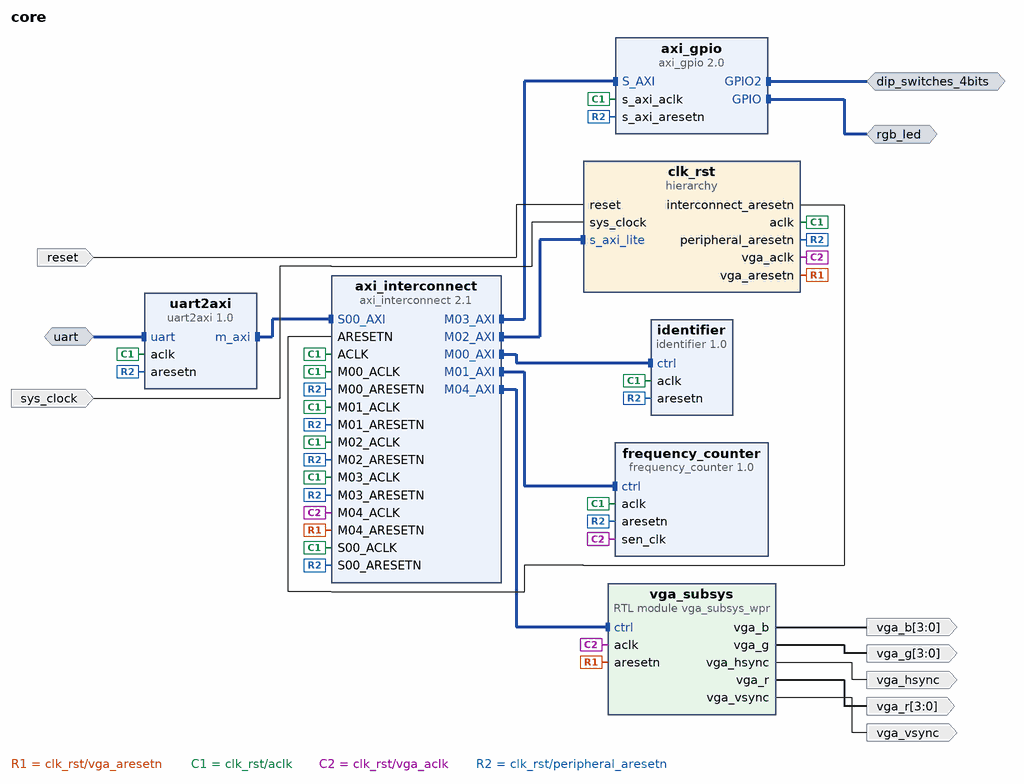
[diagram p0: block diagram of the top level]
# Vivado block design core, xc7a35ticsg324-1L, Vivado 2022.2
create_bd_design core

create_bd_intf_port -mode MirroredMaster -vlnv xilinx.com:interface:uart_rtl:1.0 uart
create_bd_intf_port -mode Master -vlnv xilinx.com:interface:gpio_rtl:1.0 rgb_led
create_bd_intf_port -mode Master -vlnv xilinx.com:interface:gpio_rtl:1.0 dip_switches_4bits
create_bd_port -dir I -type clk sys_clock
set_property -dict {CONFIG.FREQ_HZ 100000000 CONFIG.PHASE 0.0} [get_bd_ports sys_clock]
create_bd_port -dir I -type rst reset
set_property -dict {CONFIG.POLARITY ACTIVE_LOW} [get_bd_ports reset]
create_bd_port -dir O vga_hsync
create_bd_port -dir O -from 3 -to 0 vga_b
create_bd_port -dir O -from 3 -to 0 vga_r
create_bd_port -dir O -from 3 -to 0 vga_g
create_bd_port -dir O vga_vsync

create_bd_cell -type ip -vlnv xilinx.com:ip:axi_interconnect:2.1 axi_interconnect
set_property -dict {CONFIG.NUM_MI 5} [get_bd_cells axi_interconnect]
create_bd_cell -type ip -vlnv xilinx.com:ip:axi_gpio:2.0 axi_gpio
set_property -dict [list \
  CONFIG.GPIO2_BOARD_INTERFACE dip_switches_4bits \
  CONFIG.GPIO_BOARD_INTERFACE rgb_led \
  CONFIG.USE_BOARD_FLOW true \
] [get_bd_cells axi_gpio]
create_bd_cell -type hier clk_rst
create_bd_cell -type ip -vlnv lvin:versioning:identifier:1.0 identifier
set_property -dict {CONFIG.MAJOR_VERSION 2 CONFIG.MINOR_VERSION 0 CONFIG.NAME {Main build}} [get_bd_cells identifier]
create_bd_cell -type module -reference vga_subsys_wpr vga_subsys
create_bd_cell -type ip -vlnv lvin:interfaces:uart2axi:1.0 uart2axi
create_bd_cell -type ip -vlnv lvin:meters:frequency_counter:1.0 frequency_counter

# ---- hierarchy /clk_rst ----
current_bd_instance /clk_rst
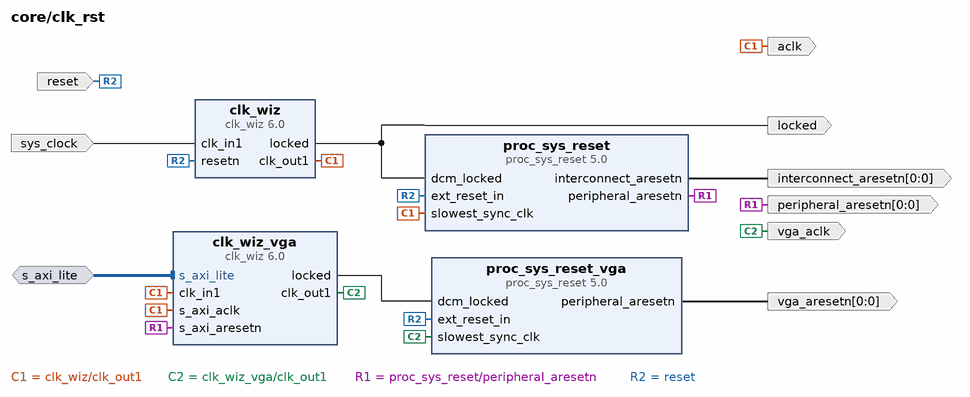
[diagram p1: block diagram inside /clk_rst]
create_bd_intf_pin -mode Slave -vlnv xilinx.com:interface:aximm_rtl:1.0 s_axi_lite
create_bd_pin -dir O -type clk aclk
create_bd_pin -dir I -type rst reset
create_bd_pin -dir O -from 0 -to 0 -type rst interconnect_aresetn
create_bd_pin -dir O -from 0 -to 0 -type rst peripheral_aresetn
create_bd_pin -dir I -type clk sys_clock
create_bd_pin -dir O locked
create_bd_pin -dir O -type clk vga_aclk
create_bd_pin -dir O -from 0 -to 0 -type rst vga_aresetn

create_bd_cell -type ip -vlnv xilinx.com:ip:proc_sys_reset:5.0 proc_sys_reset
create_bd_cell -type ip -vlnv xilinx.com:ip:clk_wiz:6.0 clk_wiz
set_property -dict [list \
  CONFIG.CLKOUT1_JITTER 130.958 \
  CONFIG.CLKOUT1_PHASE_ERROR 98.575 \
  CONFIG.CLKOUT2_JITTER 159.371 \
  CONFIG.CLKOUT2_PHASE_ERROR 98.575 \
  CONFIG.CLKOUT2_REQUESTED_OUT_FREQ 40 \
  CONFIG.CLKOUT2_USED false \
  CONFIG.CLK_IN1_BOARD_INTERFACE sys_clock \
  CONFIG.MMCM_CLKFBOUT_MULT_F 10.000 \
  CONFIG.MMCM_CLKOUT0_DIVIDE_F 10.000 \
  CONFIG.MMCM_CLKOUT1_DIVIDE 1 \
  CONFIG.NUM_OUT_CLKS 1 \
  CONFIG.RESET_BOARD_INTERFACE reset \
  CONFIG.RESET_PORT resetn \
  CONFIG.RESET_TYPE ACTIVE_LOW \
  CONFIG.USE_BOARD_FLOW true \
  CONFIG.USE_RESET true \
] [get_bd_cells clk_wiz]
create_bd_cell -type ip -vlnv xilinx.com:ip:clk_wiz:6.0 clk_wiz_vga
set_property -dict [list \
  CONFIG.CLKOUT1_JITTER 254.866 \
  CONFIG.CLKOUT1_PHASE_ERROR 297.890 \
  CONFIG.CLKOUT1_REQUESTED_OUT_FREQ 65 \
  CONFIG.MMCM_CLKFBOUT_MULT_F 50.375 \
  CONFIG.MMCM_CLKOUT0_DIVIDE_F 15.500 \
  CONFIG.MMCM_DIVCLK_DIVIDE 5 \
  CONFIG.PRIM_SOURCE Global_buffer \
  CONFIG.USE_DYN_RECONFIG true \
] [get_bd_cells clk_wiz_vga]
create_bd_cell -type ip -vlnv xilinx.com:ip:proc_sys_reset:5.0 proc_sys_reset_vga

# ---- connections ----

current_bd_instance /clk_rst
connect_bd_intf_net [get_bd_intf_pins s_axi_lite] [get_bd_intf_pins clk_wiz_vga/s_axi_lite]
connect_bd_net -net ARESETN_1 [get_bd_pins proc_sys_reset/interconnect_aresetn] [get_bd_pins interconnect_aresetn]
connect_bd_net -net clk_wiz_0_clk_out1 [get_bd_pins clk_wiz/clk_out1] \
  [get_bd_pins aclk] [get_bd_pins proc_sys_reset/slowest_sync_clk] [get_bd_pins clk_wiz_vga/clk_in1] \
  [get_bd_pins clk_wiz_vga/s_axi_aclk]
connect_bd_net -net clk_wiz_0_locked [get_bd_pins clk_wiz/locked] [get_bd_pins proc_sys_reset/dcm_locked] [get_bd_pins locked]
connect_bd_net -net clk_wiz_clk_out1 [get_bd_pins clk_wiz_vga/clk_out1] [get_bd_pins vga_aclk] [get_bd_pins proc_sys_reset_vga/slowest_sync_clk]
connect_bd_net -net clk_wiz_locked [get_bd_pins clk_wiz_vga/locked] [get_bd_pins proc_sys_reset_vga/dcm_locked]
connect_bd_net -net proc_sys_reset_0_peripheral_aresetn [get_bd_pins proc_sys_reset/peripheral_aresetn] \
  [get_bd_pins peripheral_aresetn] [get_bd_pins clk_wiz_vga/s_axi_aresetn]
connect_bd_net -net proc_sys_reset_1_peripheral_aresetn [get_bd_pins proc_sys_reset_vga/peripheral_aresetn] [get_bd_pins vga_aresetn]
connect_bd_net [get_bd_pins reset] \
  [get_bd_pins proc_sys_reset/ext_reset_in] [get_bd_pins clk_wiz/resetn] [get_bd_pins proc_sys_reset_vga/ext_reset_in]
connect_bd_net [get_bd_pins sys_clock] [get_bd_pins clk_wiz/clk_in1]

current_bd_instance /
connect_bd_intf_net [get_bd_intf_ports uart] [get_bd_intf_pins uart2axi/uart]
connect_bd_intf_net -intf_net axi_gpio_0_GPIO [get_bd_intf_ports rgb_led] [get_bd_intf_pins axi_gpio/GPIO]
connect_bd_intf_net -intf_net axi_gpio_0_GPIO2 [get_bd_intf_ports dip_switches_4bits] [get_bd_intf_pins axi_gpio/GPIO2]
connect_bd_intf_net -intf_net axi_interconnect_0_M00_AXI [get_bd_intf_pins axi_interconnect/M00_AXI] [get_bd_intf_pins identifier/ctrl]
connect_bd_intf_net -intf_net axi_interconnect_0_M01_AXI [get_bd_intf_pins axi_interconnect/M01_AXI] [get_bd_intf_pins frequency_counter/ctrl]
connect_bd_intf_net -intf_net axi_interconnect_0_M03_AXI [get_bd_intf_pins axi_interconnect/M03_AXI] [get_bd_intf_pins axi_gpio/S_AXI]
connect_bd_intf_net -intf_net axi_interconnect_0_M04_AXI [get_bd_intf_pins axi_interconnect/M04_AXI] [get_bd_intf_pins vga_subsys/ctrl]
connect_bd_intf_net [get_bd_intf_pins axi_interconnect/M02_AXI] [get_bd_intf_pins clk_rst/s_axi_lite]
connect_bd_intf_net -intf_net uart2axi_0_m_axi [get_bd_intf_pins uart2axi/m_axi] [get_bd_intf_pins axi_interconnect/S00_AXI]
connect_bd_net -net ARESETN_1 [get_bd_pins clk_rst/interconnect_aresetn] [get_bd_pins axi_interconnect/ARESETN]
connect_bd_net -net M04_ARESETN_1 [get_bd_pins clk_rst/vga_aresetn] [get_bd_pins axi_interconnect/M04_ARESETN] [get_bd_pins vga_subsys/aresetn]
connect_bd_net -net clk_wiz_0_clk_out1 [get_bd_pins clk_rst/aclk] \
  [get_bd_pins axi_interconnect/ACLK] [get_bd_pins axi_gpio/s_axi_aclk] [get_bd_pins axi_interconnect/S00_ACLK] \
  [get_bd_pins axi_interconnect/M00_ACLK] [get_bd_pins axi_interconnect/M01_ACLK] [get_bd_pins axi_interconnect/M02_ACLK] \
  [get_bd_pins identifier/aclk] [get_bd_pins axi_interconnect/M03_ACLK] [get_bd_pins uart2axi/aclk] \
  [get_bd_pins frequency_counter/aclk]
connect_bd_net -net clk_wiz_0_clk_out2 [get_bd_pins clk_rst/vga_aclk] \
  [get_bd_pins axi_interconnect/M04_ACLK] [get_bd_pins vga_subsys/aclk] [get_bd_pins frequency_counter/sen_clk]
connect_bd_net -net proc_sys_reset_0_peripheral_aresetn [get_bd_pins clk_rst/peripheral_aresetn] \
  [get_bd_pins axi_interconnect/M01_ARESETN] [get_bd_pins axi_interconnect/M00_ARESETN] \
  [get_bd_pins axi_interconnect/S00_ARESETN] [get_bd_pins axi_gpio/s_axi_aresetn] [get_bd_pins axi_interconnect/M02_ARESETN] \
  [get_bd_pins identifier/aresetn] [get_bd_pins axi_interconnect/M03_ARESETN] [get_bd_pins uart2axi/aresetn] \
  [get_bd_pins frequency_counter/aresetn]
connect_bd_net [get_bd_ports reset] [get_bd_pins clk_rst/reset]
connect_bd_net [get_bd_ports sys_clock] [get_bd_pins clk_rst/sys_clock]
connect_bd_net -net vga_subsys_wpr_0_vga_b [get_bd_pins vga_subsys/vga_b] [get_bd_ports vga_b]
connect_bd_net -net vga_subsys_wpr_0_vga_g [get_bd_pins vga_subsys/vga_g] [get_bd_ports vga_g]
connect_bd_net -net vga_subsys_wpr_0_vga_hsync [get_bd_pins vga_subsys/vga_hsync] [get_bd_ports vga_hsync]
connect_bd_net -net vga_subsys_wpr_0_vga_r [get_bd_pins vga_subsys/vga_r] [get_bd_ports vga_r]
connect_bd_net -net vga_subsys_wpr_0_vga_vsync [get_bd_pins vga_subsys/vga_vsync] [get_bd_ports vga_vsync]

# ---- address map ----
assign_bd_address -offset 0x40000000 -range 4K -target_address_space [get_bd_addr_spaces uart2axi/m_axi] [get_bd_addr_segs identifier/ctrl/reg0]
assign_bd_address -offset 0x40001000 -range 4K -target_address_space [get_bd_addr_spaces uart2axi/m_axi] [get_bd_addr_segs axi_gpio/S_AXI/Reg]
assign_bd_address -offset 0x40002000 -range 4K -target_address_space [get_bd_addr_spaces uart2axi/m_axi] [get_bd_addr_segs frequency_counter/ctrl/reg0]
assign_bd_address -offset 0x40003000 -range 4K -target_address_space [get_bd_addr_spaces uart2axi/m_axi] [get_bd_addr_segs vga_subsys/ctrl/reg0]
assign_bd_address -offset 0x40010000 -range 64K -target_address_space [get_bd_addr_spaces uart2axi/m_axi] [get_bd_addr_segs clk_rst/clk_wiz_vga/s_axi_lite/Reg]

validate_bd_design
save_bd_design
